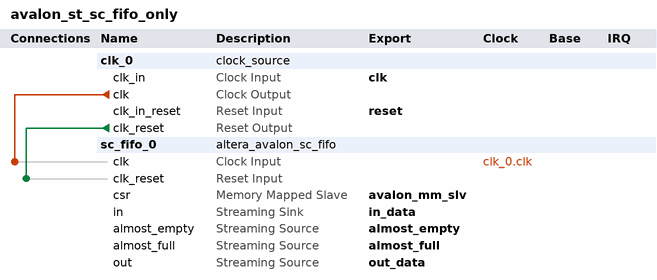
[diagram p0: system contents]
# Platform Designer (Qsys) system avalon_st_sc_fifo_only, Stratix IV EP4SGX230KF40C2
# Parameters at their usual value, and those the tool derives, are not listed.
package require -exact qsys 13.0
create_system avalon_st_sc_fifo_only
set_project_property DEVICE_FAMILY {Stratix IV}
set_project_property DEVICE EP4SGX230KF40C2

add_instance clk_0 clock_source 13.0
set_instance_parameter_value clk_0 clockFrequency 200000000

add_instance sc_fifo_0 altera_avalon_sc_fifo 13.0
set_instance_parameter_value sc_fifo_0 SYMBOLS_PER_BEAT 4
set_instance_parameter_value sc_fifo_0 BITS_PER_SYMBOL 8
set_instance_parameter_value sc_fifo_0 FIFO_DEPTH 4096
set_instance_parameter_value sc_fifo_0 CHANNEL_WIDTH 0
set_instance_parameter_value sc_fifo_0 ERROR_WIDTH 0
set_instance_parameter_value sc_fifo_0 USE_PACKETS 1
set_instance_parameter_value sc_fifo_0 USE_FILL_LEVEL 1
set_instance_parameter_value sc_fifo_0 USE_MEMORY_BLOCKS 1
set_instance_parameter_value sc_fifo_0 USE_STORE_FORWARD 1
set_instance_parameter_value sc_fifo_0 USE_ALMOST_FULL_IF 1
set_instance_parameter_value sc_fifo_0 USE_ALMOST_EMPTY_IF 1

# connections
add_connection clk_0.clk sc_fifo_0.clk clock
add_connection clk_0.clk_reset sc_fifo_0.clk_reset reset

# exported interfaces
add_interface clk clock sink
set_interface_property clk EXPORT_OF clk_0.clk_in
add_interface reset reset sink
set_interface_property reset EXPORT_OF clk_0.clk_in_reset
add_interface almost_empty avalon_streaming source
set_interface_property almost_empty EXPORT_OF sc_fifo_0.almost_empty
add_interface almost_full avalon_streaming source
set_interface_property almost_full EXPORT_OF sc_fifo_0.almost_full
add_interface out_data avalon_streaming source
set_interface_property out_data EXPORT_OF sc_fifo_0.out
add_interface in_data avalon_streaming sink
set_interface_property in_data EXPORT_OF sc_fifo_0.in
add_interface avalon_mm_slv avalon slave
set_interface_property avalon_mm_slv EXPORT_OF sc_fifo_0.csr

set_interconnect_requirement {$system} qsys_mm.clockCrossingAdapter HANDSHAKE
set_interconnect_requirement {$system} qsys_mm.maxAdditionalLatency 1

save_system avalon_st_sc_fifo_only.qsys
